# EAGLE design C64_SVideo_Cable_Pro (EAGLE 9.5.2)
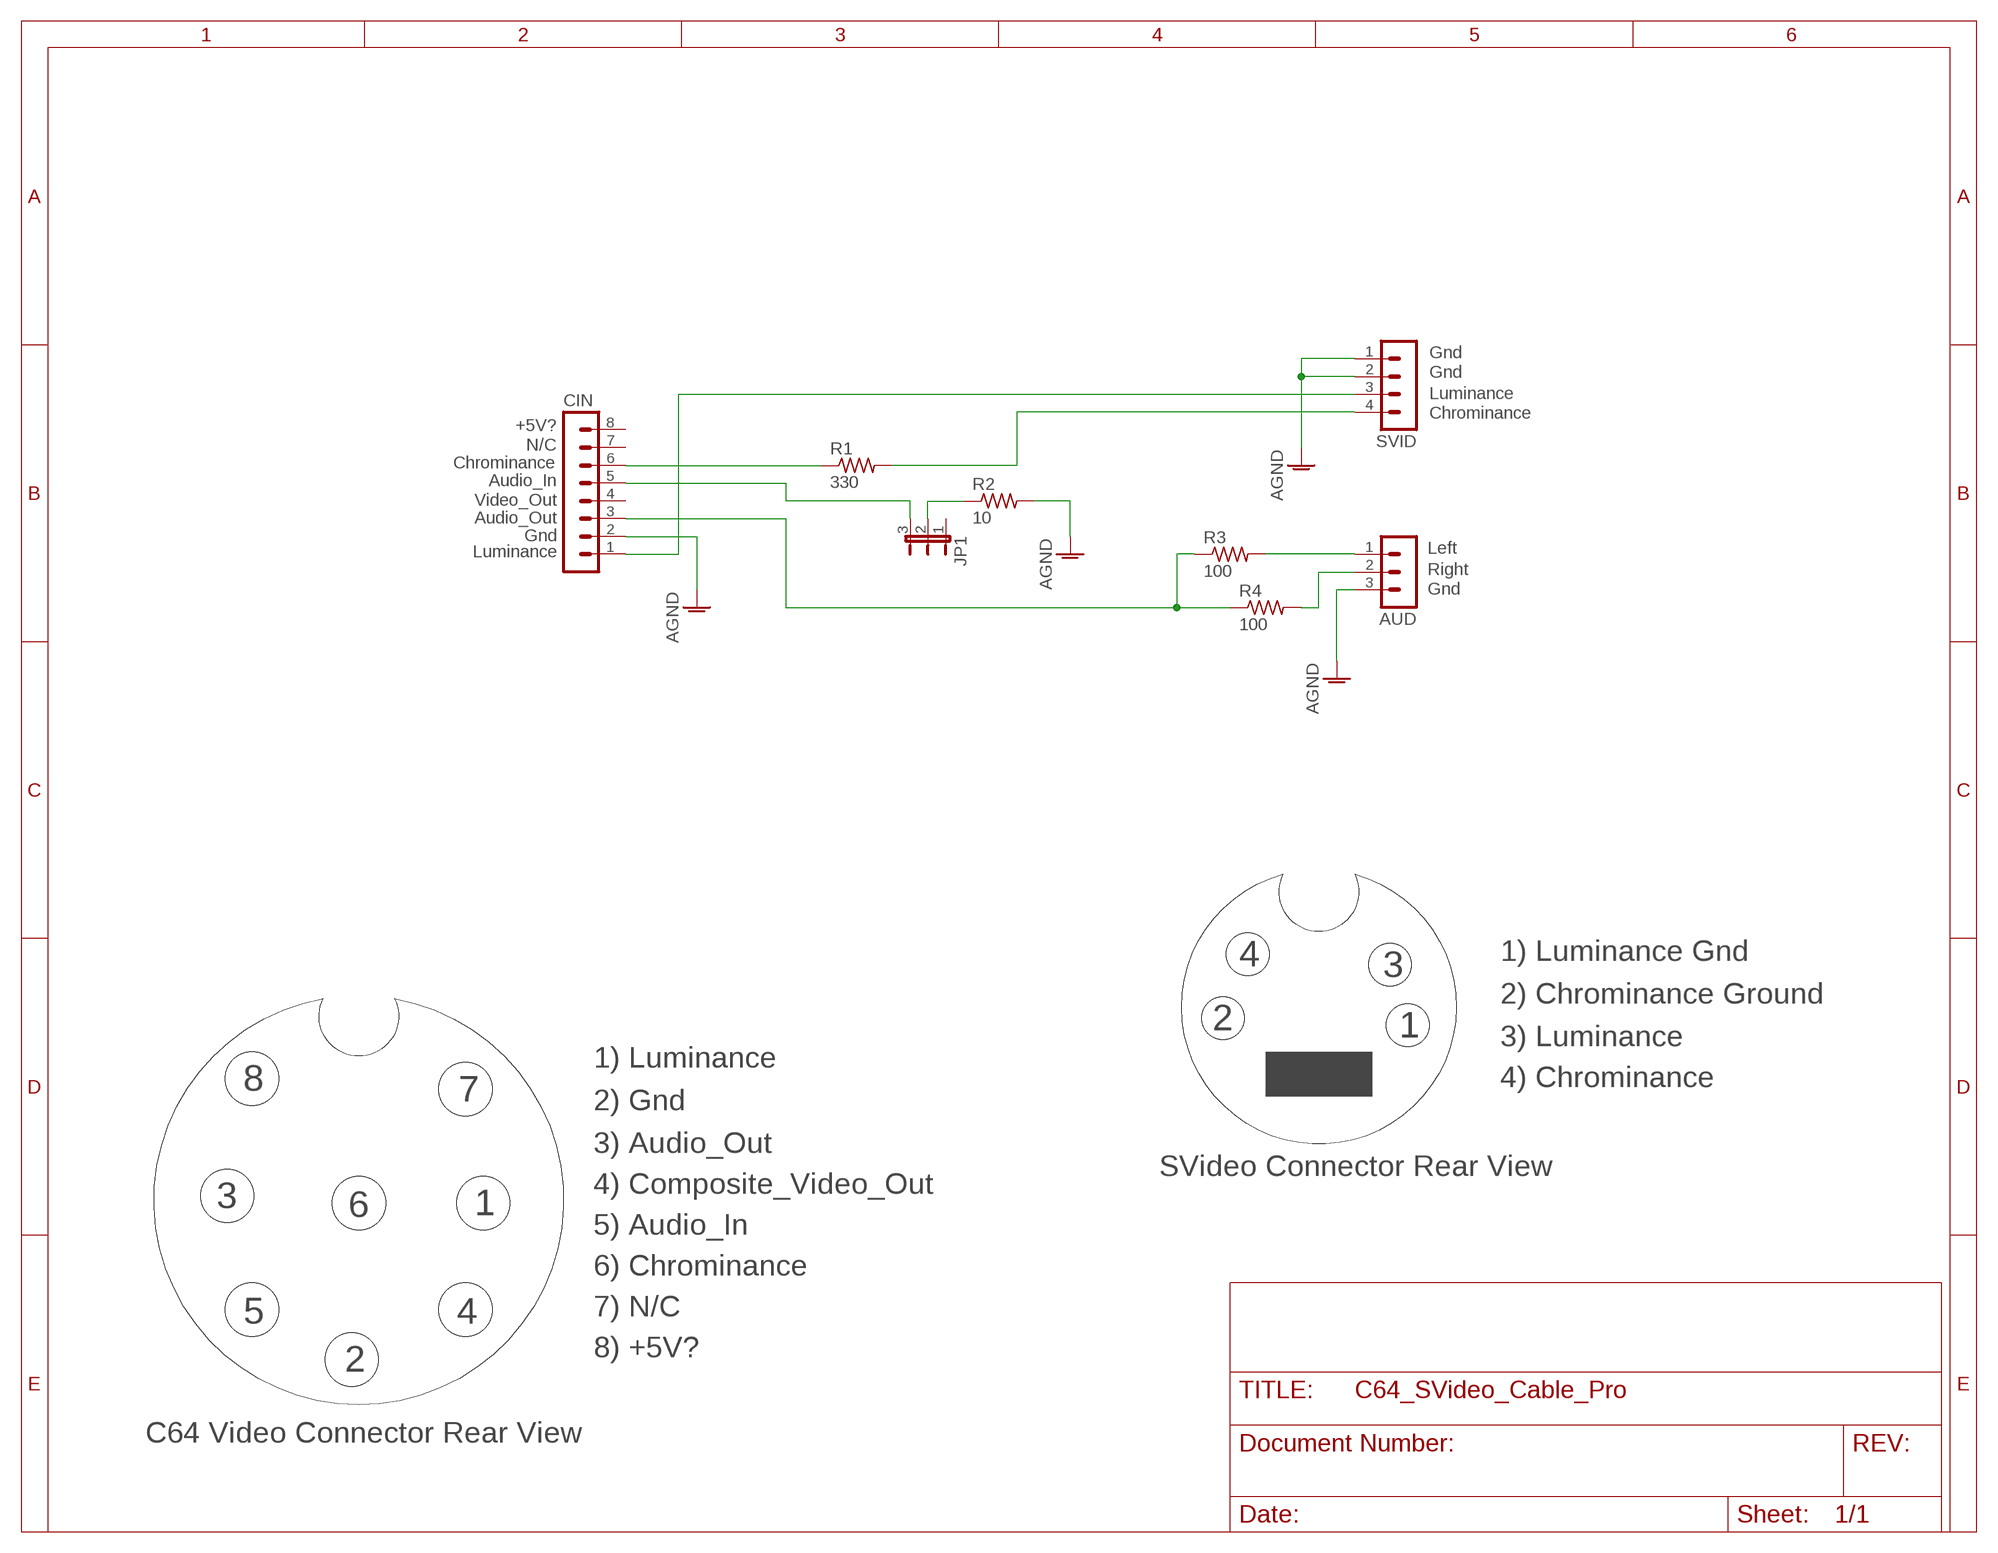
[diagram p0: schematic, sheet 1]

## Parts
AUD  MA03-1  [MA03-1]
CIN  MA08-1  [MA08-1]
JP1  JP2E  [JP2]
R1  330  R-US_0309/12  [0309/12]
R2  10  R-US_0309/12  [0309/12]
R3  100  R-US_0309/12  [0309/12]
R4  100  R-US_0309/12  [0309/12]
SVID  MA04-1  [MA04-1]

## Nets
AGND: AUD.3 CIN.2 R2.2 SVID.1 SVID.2
N$1: CIN.6 R1.1
N$2: R1.2 SVID.4
N$3: AUD.1 R3.2
N$4: AUD.2 R4.2
N$5: CIN.5 JP1.3
N$6: JP1.2 R2.1
N$7: CIN.3 R3.1 R4.1
N$9: CIN.1 SVID.3
Unconnected: CIN.4 CIN.7 CIN.8 JP1.1

## Notes on the sheet
- Gnd
- Gnd
- Luminance
- Chrominance
- +5V?
- N/C
- Chrominance
- Audio_In
- Video_Out
- Audio_Out
- Gnd
- Luminance | Left
- Right
- Gnd
- 4 | 1) Luminance Gnd
- 3
- 2) Chrominance Ground
- 2 | 1
- 3) Luminance
- 1) Luminance
- 8 | 4) Chrominance
- 7
- 2) Gnd
- 3) Audio_Out
- SVideo Connector Rear View
- 4) Composite_Video_Out
- 3 | 6 | 1
- 5) Audio_In
- 6) Chrominance
- 5 | 4 | 7) N/C
- 8) +5V?
- 2
- C64 Video Connector Rear View

## Library data of the parts
AUD = con-lstb:MA03-1: PIN HEADER; OC_FARNELL: unknown; OC_NEWARK: unknown
CIN = con-lstb:MA08-1: PIN HEADER; OC_FARNELL: unknown; OC_NEWARK: unknown
JP1 = jumper:JP2E: JUMPER
R1-R4 = rcl:R-US_: RESISTOR, American symbol; SPICEPREFIX: R
SVID = con-lstb:MA04-1: PIN HEADER; OC_FARNELL: unknown; OC_NEWARK: unknown

## Board
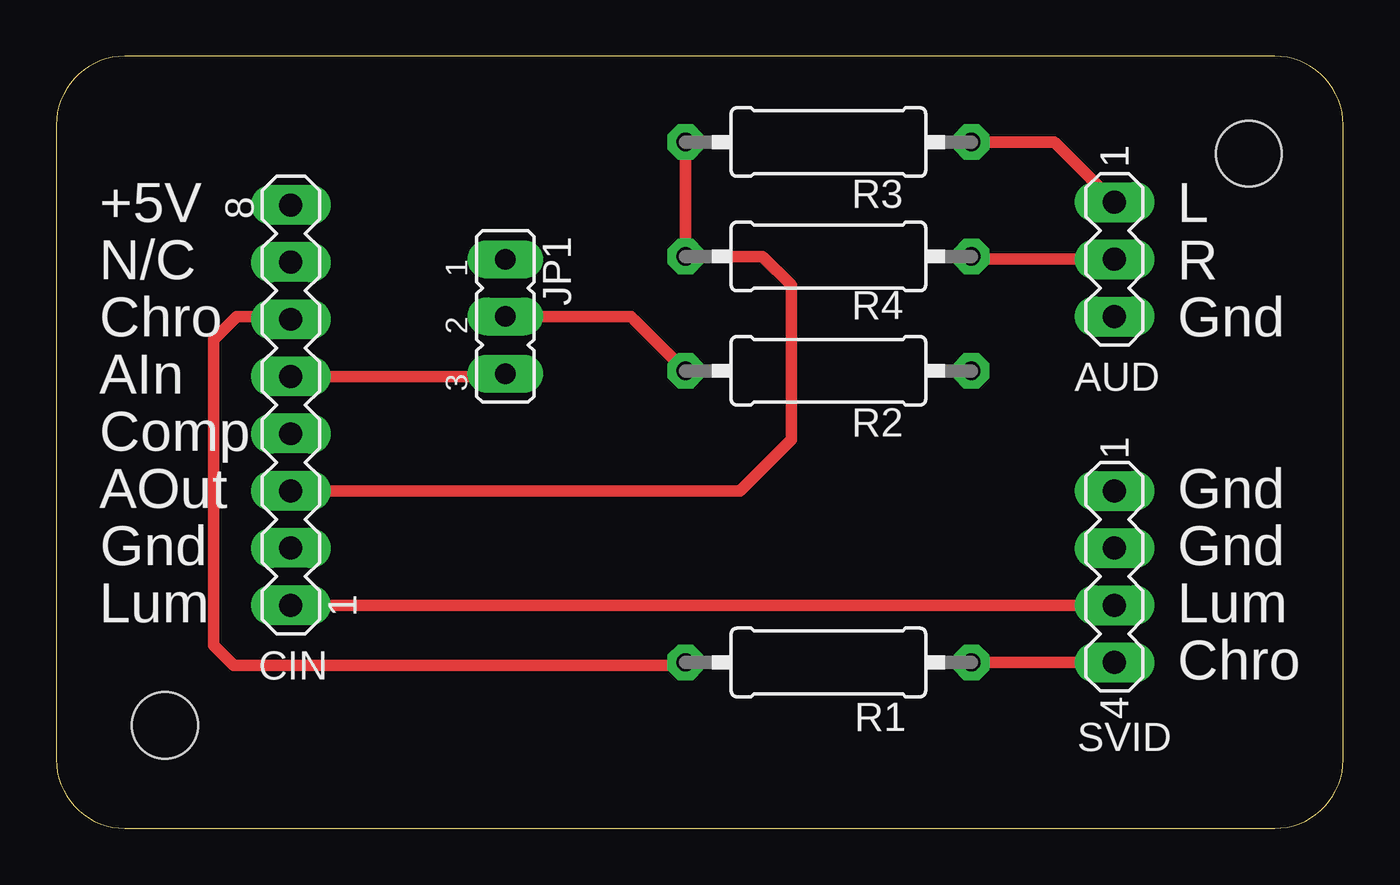
[diagram p1: board, top side]
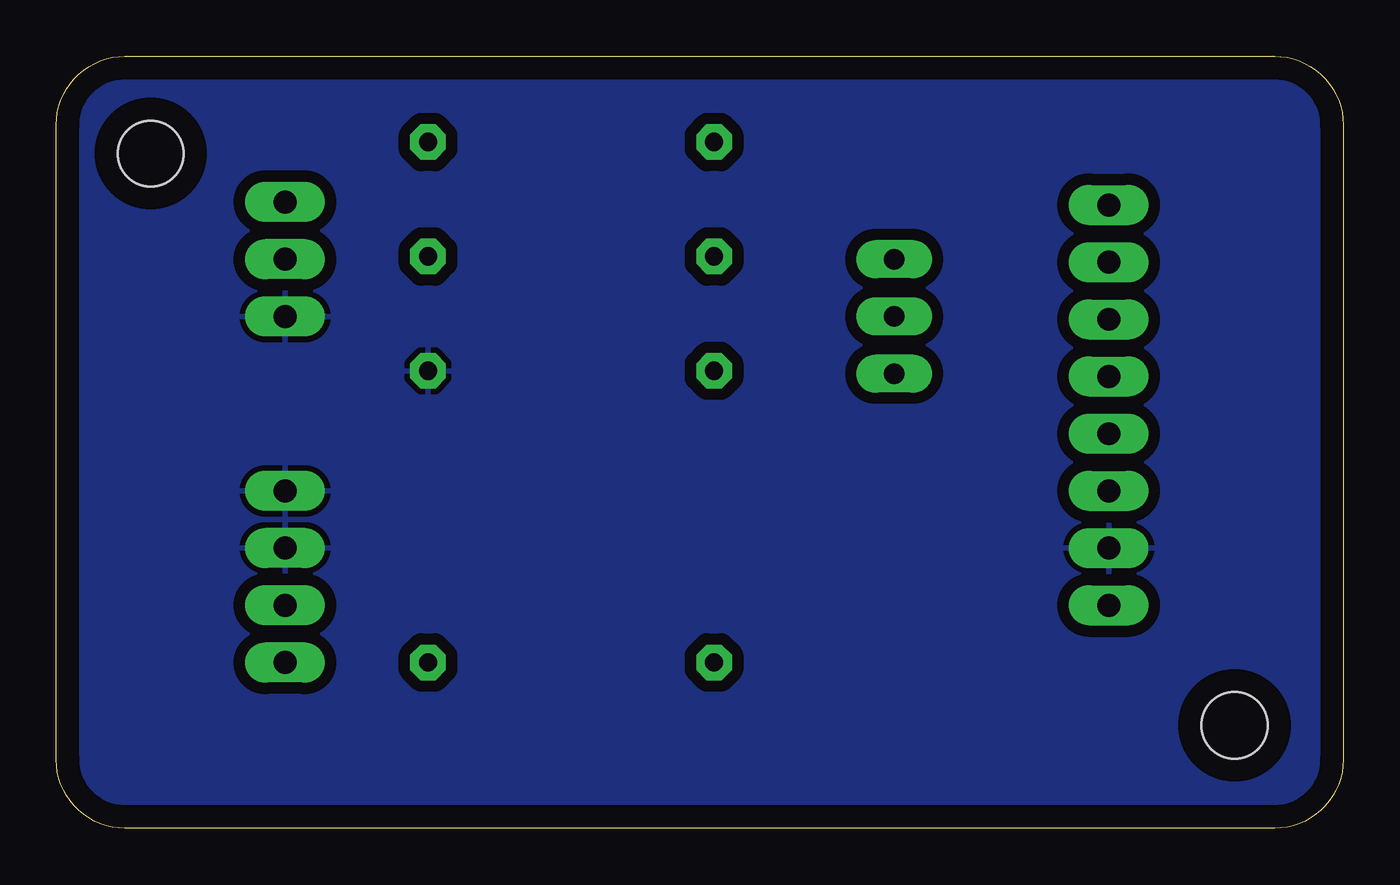
[diagram p2: board, bottom side, seen from below]

Size 57.15 x 34.29 mm. Coordinates in mm from the lower left corner, seen from the top.
Outline: 0,31.24 0,3.05 arc90 3.05,0 54.1,0 arc90 57.15,3.05 57.15,31.24 arc90 54.1,34.29 3.05,34.29 arc90 0,31.24
Copper layers (1*16): Top 0.035mm / dielectric 1.5mm / Bottom 0.035mm
Design rules "default *": minimum track width 6mil, minimum drill 0.35mm, track to track 20mil, track to pad 20mil, pad to pad 20mil, via to via 20mil, smd to smd 6mil, copper to edge 40mil, drill to drill 6mil, minimum pad ring 15mil, minimum via ring 8mil, stop-mask expansion 4mil, vias tented up to drill 0mil, thermal gap 10mil
Holes 2.95 mm at 4.83,4.57
Holes 2.92 mm at 52.96,29.97

### Footprints (pad centres in the part's own frame; a part is rotated, then mirrored left to right if it is on the bottom)
MA03-1 = drill 1.016 long: 1 -2.54,0; 2 0,0; 3 2.54,0
MA08-1 = drill 1.016 long: 1 -8.89,0; 2 -6.35,0; 3 -3.81,0; 4 -1.27,0; 5 1.27,0; 6 3.81,0; 7 6.35,0; 8 8.89,0
JP2 = drill 0.914 long: 1 -2.54,0; 2 0,0; 3 2.54,0
0309/12 = drill 0.813 octagon: 1 -6.35,0; 2 6.35,0
MA04-1 = drill 1.016 long: 1 -3.81,0; 2 -1.27,0; 3 1.27,0; 4 3.81,0

### Placement (x,y rotation side)
AUD  46.99,25.27 270 top
CIN  10.41,18.8 90 top
JP1  19.94,22.73 270 top
R1  34.29,7.37 0 top
R2  34.29,20.32 0 top
R3  34.29,30.48 0 top
R4  34.29,25.4 0 top
SVID  46.99,11.18 270 top

### Tracks (layer width: path | path; a pad name or v marks a point on that pad's centre or on a via)
AGND
  pour Bottom: 59.69,37.72 59.69,-2.79 -2.16,-2.79 -2.67,-2.29 -2.67,37.59 -2.54,37.72
N$1
  Top 0.406: 27.81,7.24 R1.1
  Top 0.508: 27.81,7.24 7.87,7.24 6.99,8.13 6.99,21.72 8,22.73 10.29,22.73 CIN.6
N$2
  Top 0.508: R1.2 SVID.4
N$3
  Top 0.508: AUD.1 44.32,30.48 R3.2
N$4
  Top 0.508: AUD.2 41.4,25.27 R4.2
N$5
  Top 0.508: CIN.5 19.81,20.07 JP1.3
N$6
  Top 0.406: 25.65,22.61 25.53,22.73
  Top 0.508: R2.1 25.65,22.61 | 25.53,22.73 JP1.2
N$7
  Top 0.508: R3.1 R4.1 31.37,25.4 32.64,24.13 32.64,17.27 30.35,14.99 CIN.3
N$9
  Top 0.508: CIN.1 SVID.3

### Text on the board
tNames: +5V | L | N/C | R | Chro | Gnd | AIn | Comp | AOut | Gnd | Gnd | Gnd | Lum | Lum | Chro